# Altium project UZ_PER_SKAI3_LV_48V_410A.PrjPCB (part 1 of 2)
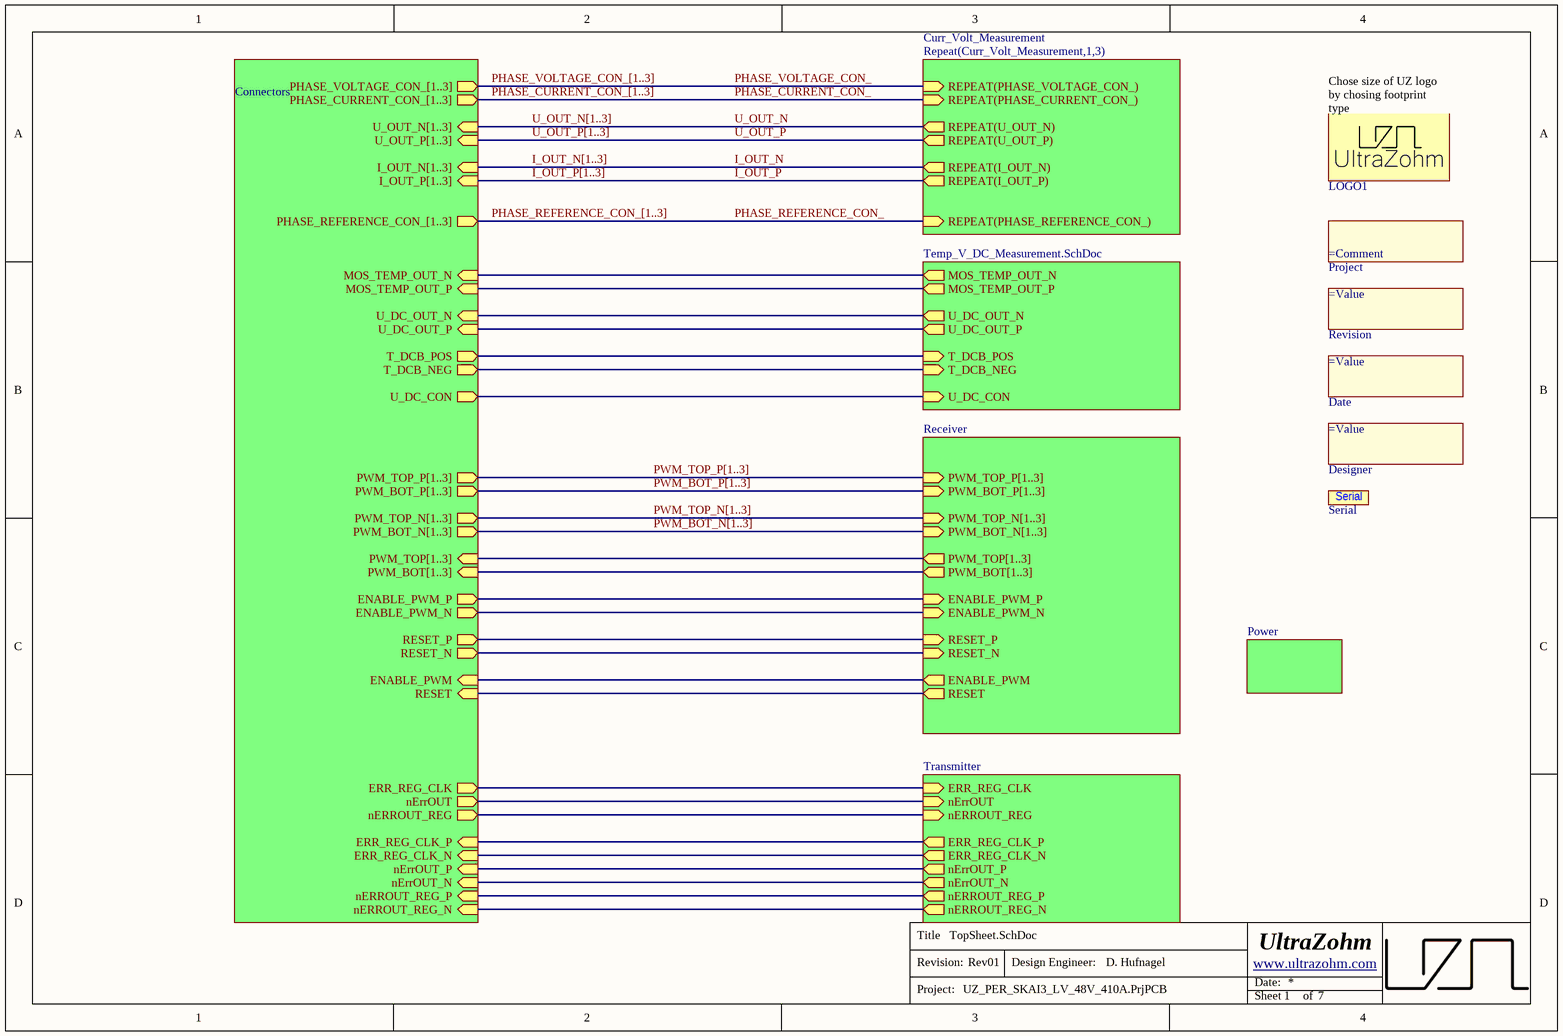
[diagram p0: TopSheet.SchDoc]
Author: D. Hufnagel; AuthorParam: D. Hufnagel; FinDate: 04/24; ProjectNameCustom: UZ_PER_SKAI3_LV_48V_410A; ProjectRevision: Rev01
7 sheets, 175 parts. Net scope: hierarchical (ports join the sheet entries above them; power ports are global).
Board file: UZ_PER_SKAI3_LV_48V_410A.PcbDoc
Sheets:
  TopSheet.SchDoc
     = Temp_V_DC_Measurement.SchDoc
     = Connectors.SchDoc
    Curr_Volt_Measurement1 = Curr_Volt_Measurement.SchDoc
    Curr_Volt_Measurement2 = Curr_Volt_Measurement.SchDoc
    Curr_Volt_Measurement3 = Curr_Volt_Measurement.SchDoc
     = Receiver.SchDoc
    Designator = Transmitter.SchDoc
    Designator = Power.SchDoc

## Sheet TopSheet.SchDoc
size A4; Author: D. Hufnagel; CompanyName: Technische Hochschule Nürnberg Georg Simon Ohm; Organization: UltraZohm; Address1: Kesslerplatz 12; Address2: 90489 Nürnberg; Address3: GERMANY; DocumentNumber: 1; SheetNumber: 1; SheetTotal: 7; Website: www.ultrazohm.com

### Parts
Date  (no value)  [COMMENT]  (no BOM)
Designer  (no value)  [Designator:comment]  (no BOM)
LOGO1  UZ Logo  [UZ_Logo_small]  (value not drawn)  (no BOM)
Project  (no value)  [COMMENT]  (no BOM)
Revision  (no value)  [Designator:comment]  (no BOM)
Serial  Serial #  [SERIAL]  (value not drawn)

### Sub-sheets
Designator = Transmitter: ERR_REG_CLK (in), nErrOUT (in), nERROUT_REG (in), ERR_REG_CLK_P (out), ERR_REG_CLK_N (out), nErrOUT_P (out), nErrOUT_N (out), nERROUT_REG_P (out), nERROUT_REG_N (out)
Designator = Power: no entries
Repeat(Curr_Volt_Measurement,1,3) = Curr_Volt_Measurement: REPEAT(PHASE_VOLTAGE_CON_) (in), REPEAT(U_OUT_N) (out), REPEAT(U_OUT_P) (out), REPEAT(PHASE_CURRENT_CON_) (in), REPEAT(PHASE_REFERENCE_CON_) (in), REPEAT(I_OUT_N) (out), REPEAT(I_OUT_P) (out)
? = Temp_V_DC_Measurement.SchDoc: MOS_TEMP_OUT_N (out), MOS_TEMP_OUT_P (out), U_DC_OUT_N (out), U_DC_OUT_P (out), T_DCB_POS (in), T_DCB_NEG (in), U_DC_CON (in)
? = Connectors: PHASE_REFERENCE_CON_[1..3] (out), U_OUT_P[1..3] (in), U_OUT_N[1..3] (in), PHASE_CURRENT_CON_[1..3] (out), PHASE_VOLTAGE_CON_[1..3] (out), U_DC_OUT_P (in), U_DC_OUT_N (in), MOS_TEMP_OUT_P (in), MOS_TEMP_OUT_N (in), PWM_TOP_P[1..3] (out), PWM_BOT_P[1..3] (out), PWM_TOP_N[1..3] (out), PWM_BOT_N[1..3] (out), ENABLE_PWM_P (out), ENABLE_PWM_N (out), RESET_P (out), RESET_N (out), ENABLE_PWM (in), RESET (in), ERR_REG_CLK (out), nErrOUT (out), nERROUT_REG (out), ERR_REG_CLK_P (in), ERR_REG_CLK_N (in), nErrOUT_P (in), nErrOUT_N (in), nERROUT_REG_P (in), nERROUT_REG_N (in), T_DCB_POS (out), T_DCB_NEG (out), U_DC_CON (out), PWM_BOT[1..3] (in), PWM_TOP[1..3] (in), I_OUT_N[1..3] (in), I_OUT_P[1..3] (in)
? = Receiver: PWM_TOP_P[1..3] (in), PWM_BOT_P[1..3] (in), PWM_TOP_N[1..3] (in), PWM_BOT_N[1..3] (in), ENABLE_PWM_P (in), ENABLE_PWM_N (in), RESET_P (in), RESET_N (in), ENABLE_PWM (out), RESET (out), PWM_BOT[1..3] (out), PWM_TOP[1..3] (out)

### Nets
ENABLE_PWM: sheet /ENABLE_PWM, sheet /ENABLE_PWM
ENABLE_PWM_N: sheet /ENABLE_PWM_N, sheet /ENABLE_PWM_N
ENABLE_PWM_P: sheet /ENABLE_PWM_P, sheet /ENABLE_PWM_P
ERR_REG_CLK: sheet /ERR_REG_CLK, sheet Designator/ERR_REG_CLK
ERR_REG_CLK_N: sheet /ERR_REG_CLK_N, sheet Designator/ERR_REG_CLK_N
ERR_REG_CLK_P: sheet /ERR_REG_CLK_P, sheet Designator/ERR_REG_CLK_P
I_OUT_N: sheet Repeat(Curr_Volt_Measurement,1,3)/REPEAT(I_OUT_N)
I_OUT_P: sheet Repeat(Curr_Volt_Measurement,1,3)/REPEAT(I_OUT_P)
MOS_TEMP: sheet /T_DCB_POS, sheet /T_DCB_POS
MOS_TEMP_OUT_N: sheet /MOS_TEMP_OUT_N, sheet /MOS_TEMP_OUT_N
MOS_TEMP_OUT_P: sheet /MOS_TEMP_OUT_P, sheet /MOS_TEMP_OUT_P
nErrOUT: sheet /nErrOUT, sheet Designator/nErrOUT
nErrOUT_N: sheet /nErrOUT_N, sheet Designator/nErrOUT_N
nErrOUT_P: sheet /nErrOUT_P, sheet Designator/nErrOUT_P
nERROUT_REG: sheet /nERROUT_REG, sheet Designator/nERROUT_REG
nERROUT_REG_N: sheet /nERROUT_REG_N, sheet Designator/nERROUT_REG_N
nERROUT_REG_P: sheet /nERROUT_REG_P, sheet Designator/nERROUT_REG_P
PHASE_CURRENT_CON_: sheet Repeat(Curr_Volt_Measurement,1,3)/REPEAT(PHASE_CURRENT_CON_)
PHASE_REFERENCE_CON_: sheet Repeat(Curr_Volt_Measurement,1,3)/REPEAT(PHASE_REFERENCE_CON_)
PHASE_VOLTAGE_CON_: sheet Repeat(Curr_Volt_Measurement,1,3)/REPEAT(PHASE_VOLTAGE_CON_)
RESET: sheet /RESET, sheet /RESET
RESET_N: sheet /RESET_N, sheet /RESET_N
RESET_P: sheet /RESET_P, sheet /RESET_P
T_DCB_NEG: sheet /T_DCB_NEG, sheet /T_DCB_NEG
U_DC_OUT_N: sheet /U_DC_OUT_N, sheet /U_DC_OUT_N
U_DC_OUT_P: sheet /U_DC_OUT_P, sheet /U_DC_OUT_P
U_OUT_N: sheet Repeat(Curr_Volt_Measurement,1,3)/REPEAT(U_OUT_N)
U_OUT_P: sheet Repeat(Curr_Volt_Measurement,1,3)/REPEAT(U_OUT_P)
NetC25_2: sheet /U_DC_CON, sheet /U_DC_CON

### Buses and harness runs
bus I_OUT_N[1..3] = sheet /I_OUT_N[1..3]
bus I_OUT_P[1..3] = sheet /I_OUT_P[1..3]
bus PHASE_CURRENT_CON_[1..3] = sheet /PHASE_CURRENT_CON_[1..3]
bus PHASE_REFERENCE_CON_[1..3] = sheet /PHASE_REFERENCE_CON_[1..3]
bus PHASE_VOLTAGE_CON_[1..3] = sheet /PHASE_VOLTAGE_CON_[1..3]
bus PWM_BOT_N[1..3] = sheet /PWM_BOT_N[1..3]
bus PWM_BOT_P[1..3] = sheet /PWM_BOT_P[1..3]
bus PWM_TOP_N[1..3] = sheet /PWM_TOP_N[1..3]
bus PWM_TOP_P[1..3] = sheet /PWM_TOP_P[1..3]
bus U_OUT_N[1..3] = sheet /U_OUT_N[1..3]
bus U_OUT_P[1..3] = sheet /U_OUT_P[1..3]

### Notes on the sheet
- (near LOGO1) Chose size of UZ logo by chosing footprint type
- Title
- Revision:
- Design Engineer:
- Date:
- Project:
- Sheet
- of

### Library data of the parts
Date = 5: Create a project parameter named "FinDate" this is the value of this component. It is printed on the PCB. Once the parameter is updated (e.g. new revision) it gets updated on the PCB as well; Manufacturer: PCB Manufacturer; Manufacturer Part Number: Project End Date; Value: 04/24; Created from: T. Wendt; PartID: 5; Created On: 01.03.2021 09:01:41; Component Type: Date of Project Finalization; Last Updated: 01.03.2021 09:01:41; Type: Standard (No BOM); Live Cycle Status: 1
Designer = 4: Create a project parameter named "Author" this is the value of this component. It is printed on the PCB. Once the parameter is updated (e.g. new revision) it gets updated on the PCB as well; Manufacturer: PCB Manufacturer; Manufacturer Part Number: Project Author; Value: D. Hufnagel; Created from: T. Wendt; PartID: 4; Created On: 01.03.2021 08:53:41; Component Type: Project Author; Last Updated: 01.03.2021 09:20:27; Type: Standard (No BOM); Live Cycle Status: 1
LOGO1 = 1: Official Project Logo of the UltraZohm; Manufacturer: PCB Manufacturer; Manufacturer Part Number: UltraZohm Logo; Created from: T. Wendt; PartID: 1; Created On: 19.02.2021 16:55:56; ComponentLink1Description: Homepage; ComponentLink1URL: https://ultrazohm.com; Component Type: Logo; Last Updated: 02.03.2021 14:31:24; Type: Standard (No BOM); Live Cycle Status: 1
Project = 2: Create a project parameter named "ProjectNameCustom" this is the value of this component and it is printed on the PCB.; Manufacturer: PCB Manufacturer; Value: UZ_PER_SKAI3_LV_48V_410A; Created from: T. Wendt; PartID: 2; Created On: 01.03.2021 08:43:57; Component Type: Project Name; Last Updated: 01.03.2021 09:07:27; Manufacturer Part Number: Project Name; Type: Standard (No BOM); Live Cycle Status: 1
Revision = 3: Create a project parameter named "ProjectRevision" this is the value of this component. It is printed on the PCB. Once the parameter is updated (e.g. new revision) it gets updated on the PCB as well; Manufacturer: PCB Manufacturer; Value: Rev01; Created from: T. Wendt; PartID: 3; Created On: 01.03.2021 08:50:34; Component Type: Project Revision; Last Updated: 01.03.2021 09:28:36; Manufacturer Part Number: Project Revision; Type: Standard (No BOM); Live Cycle Status: 1
Serial = 6: Field to put in a serial number; Manufacturer: PCB Manufacturer; Created from: T. Wendt; PartID: 6; Created On: 02.03.2021 14:31:24; Component Type: Serial Number; Last Updated: 02.03.2021 14:31:24; Manufacturer Part Number: Serial Number; Type: Standard (No BOM); Live Cycle Status: 1

## Sheet Temp_V_DC_Measurement.SchDoc
size A4; Author: D. Hufnagel; CompanyName: Technische Hochschule Nürnberg Georg Simon Ohm; Organization: UltraZohm; Address1: Kesslerplatz 12; Address2: 90489 Nürnberg; Address3: GERMANY; SheetNumber: 5; SheetTotal: 7; Website: www.ultrazohm.com
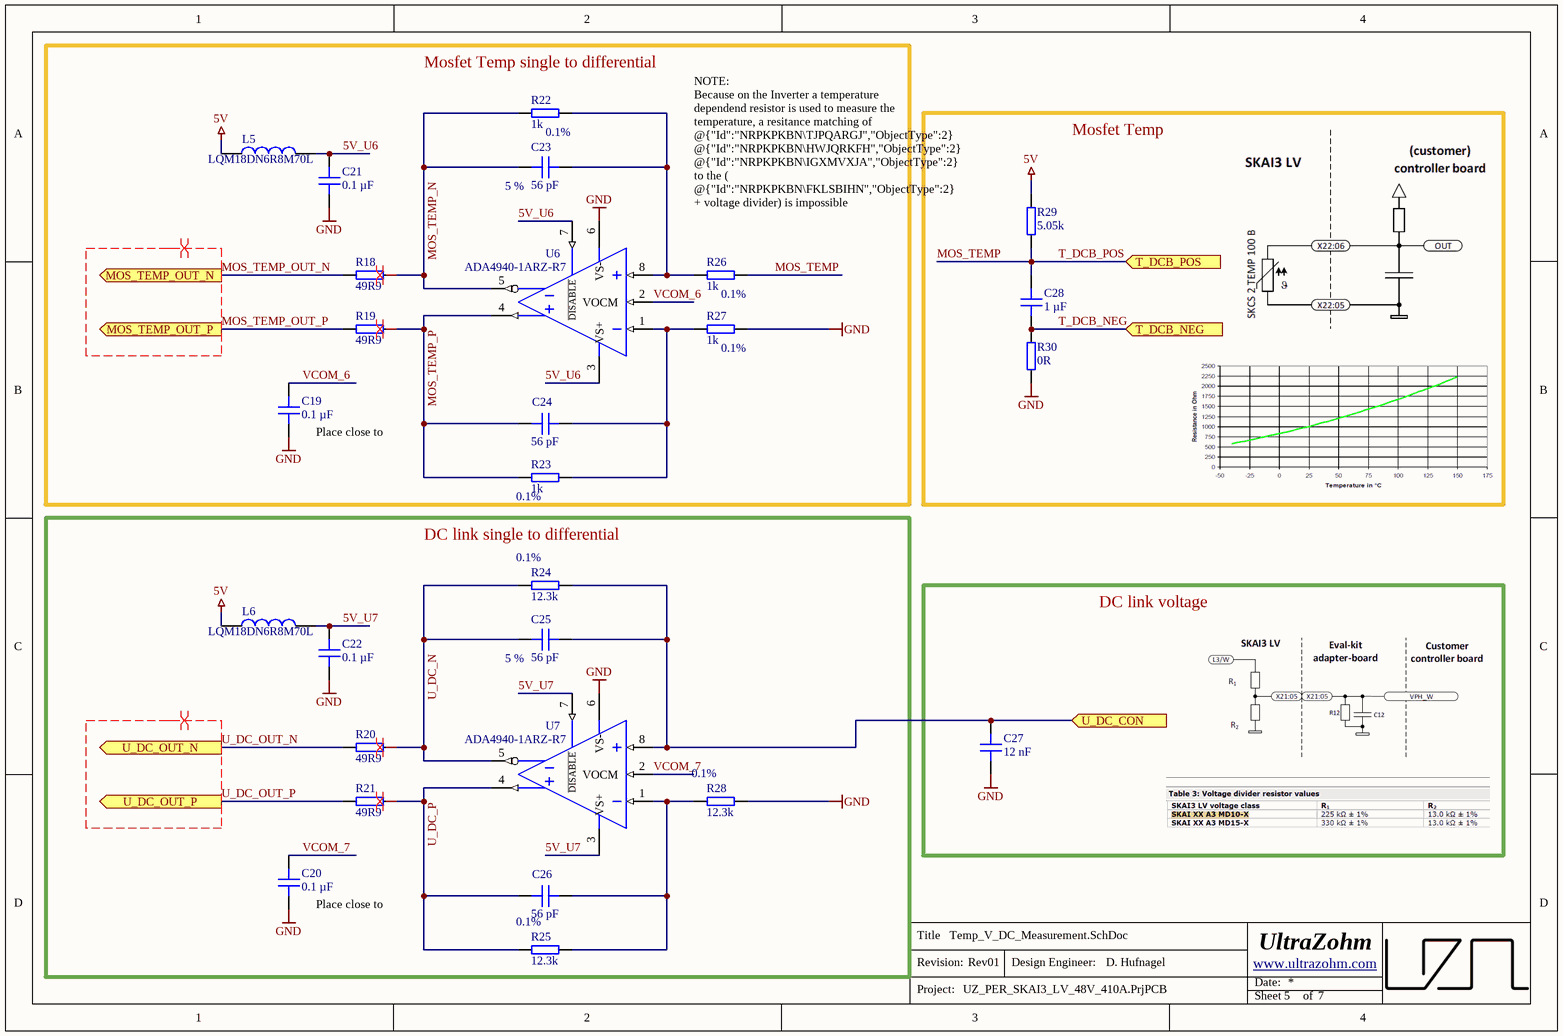
[diagram p1: Temp_V_DC_Measurement.SchDoc]

### Parts
C19  0.1 µF  [C_0603]
C20  0.1 µF  [C_0603]
C21  0.1 µF  [C_0603]
C22  0.1 µF  [C_0603]
C23  56 pF  Tolerance: 5 %  [C_0603]
C24  56 pF  [C_0603]
C25  56 pF  Tolerance: 5 %  [C_0603]
C26  56 pF  [C_0603]
C27  12 nF  [C_0603]
C28  1 µF  [C_1206]
L5  LQM18DN6R8M70L  [INDC1608X95N]
L6  LQM18DN6R8M70L  [INDC1608X95N]
R18  49R9  [RES 0603_1608]
R19  49R9  [RES 0603_1608]
R20  49R9  [RES 0603_1608]
R21  49R9  [RES 0603_1608]
R22  1k  Tolerance: 0.1%  [RES 0603_1608]
R23  1k  Tolerance: 0.1%  [RES 0603_1608]
R24  12.3k  Tolerance: 0.1%  [RES 0603_1608]
R25  12.3k  Tolerance: 0.1%  [RES 0603_1608]
R26  1k  Tolerance: 0.1%  [RES 0603_1608]
R27  1k  Tolerance: 0.1%  [RES 0603_1608]
R28  12.3k  Tolerance: 0.1%  [RES 0603_1608]
R29  5.05k  [RES 0603_1608]
R30  0R  [RES 0603_1608]
U6  ADA4940-1ARZ-R7  [SOT127P600X175-8N]
U7  ADA4940-1ARZ-R7  [SOT127P600X175-8N]

### Blocks framed on the sheet
Mosfet Temp single to differential: C19 C21 C23 C24 L5 R18 R19 R22 R23 R26 R27 U6
Mosfet Temp: C28 R29 R30
DC link single to differential: C20 C22 C25 C26 L6 R20 R21 R24 R25 R28 U7
DC link voltage: C27

### Ports
MOS_TEMP_OUT_N (out), MOS_TEMP_OUT_P (out), T_DCB_NEG (in), T_DCB_POS (in), U_DC_CON (in), U_DC_OUT_N (out), U_DC_OUT_P (out)

### Nets
5V: L5.1 L6.1 R29.2
GND: C19.1 C20.1 C21.1 C22.1 C27.1 R27.1 R28.2 R30.1 U6.6(VS-) U7.6(VS-)
5V_U6: C21.2 L5.2 U6.3(VS+) U6.7(~{DISABLE})
5V_U7: C22.2 L6.2 U7.3(VS+) U7.7(~{DISABLE})
MOS_TEMP: C28.2 R26.1 R29.1 ; port T_DCB_POS  [also labelled T_DCB_POS]
MOS_TEMP_N: C23.1 R18.2 R22.2 U6.5(VOUT-)
MOS_TEMP_OUT_N: R18.1 ; port MOS_TEMP_OUT_N
MOS_TEMP_OUT_P: R19.1 ; port MOS_TEMP_OUT_P
MOS_TEMP_P: C24.1 R19.2 R23.2 U6.4(VOUT+)
T_DCB_NEG: C28.1 R30.2 ; port T_DCB_NEG
U_DC_N: C25.1 R20.2 R24.1 U7.5(VOUT-)
U_DC_OUT_N: R20.1 ; port U_DC_OUT_N
U_DC_OUT_P: R21.1 ; port U_DC_OUT_P
U_DC_P: C26.1 R21.2 R25.1 U7.4(VOUT+)
VCOM_6: C19.2 U6.2(VOCM)
VCOM_7: C20.2 U7.2(VOCM)
NetC23_2: C23.2 R22.1 R26.2 U6.8(VIN+)
NetC24_2: C24.2 R23.1 R27.2 U6.1(VIN-)
NetC25_2: C25.2 C27.2 R24.2 U7.8(VIN+) ; port U_DC_CON
NetC26_2: C26.2 R25.2 R28.1 U7.1(VIN-)

### Layout directives
differential pair: MOS_TEMP_N, MOS_TEMP_OUT_N, MOS_TEMP_OUT_P, MOS_TEMP_P, U_DC_N, U_DC_OUT_N, U_DC_OUT_P, U_DC_P

### Notes on the sheet
- (near R26) NOTE:
  Because on the Inverter a temperature dependend resistor is used to measure the temperature, a resitance matching of @{"Id":"NRPKPKBN\TJPQARGJ","ObjectType":2} @{"Id":"NRPKPKBN\HWJQRKFH","ObjectType":2} @{"Id":"NRPKPKBN\IGXMVXJA","ObjectType":2} to the ( @{"Id":"NRPKPKBN\FKLSBIHN","ObjectType":2} + voltage divider) is impossible
- (near C19) Place close to @{"Id":"NRPKPKBN\YIMAHXXS","ObjectType":2}
- (near C20) Place close to @{"Id":"NRPKPKBN\RQVLHYIW","ObjectType":2}
- Title
- Revision:
- Design Engineer:
- Date:
- Project:
- Sheet
- of

### Library data of the parts
C19-C22 = C0603X104K5RAC7411: Capacitor 0603, 50 VDC, 0.1 µF, X7R; Manufacturer: KEMET; Tolerance: 10 %; Voltage Rating: 50 VDC; Created from: MGremer; Manufacturer Part Number: C0603X104K5RAC7411; PartID: 3; Created On: 20.12.2020 13:54:13; ComponentLink1Description: Datasheet; ComponentLink1URL: https://www.mouser.de/datasheet/2/212/1/KEM_C1013_X7R_FT_CAP_SMD-1103280.pdf; Component Type: Capacitor 0603; Device Package: 0603; Last Updated: 04.03.2021 09:24:28; Mounting Type: SMD; Operating Temperature: -55 - 125°C; Series: SMD Comm X7R Flex; Supplier 1: Mouser; Supplier Part Number 1: 80-C0603X104K5R7411; Supplier 2: LCSC; Supplier Part Number 2: C14663; Type: Capacitor; Value: 0.1 µF; Live Cycle Status: 1; LCSC Part Number: C14663; Stock number: Labor SMD Container
C23 C25 = CL10C560JB8NNNC: Capacitor 0603, 50 VDC, 56 pF, C0G; Manufacturer: Samsung Electro-Mechanics; Voltage Rating: 50 VDC; Created from: DHufnagel; Manufacturer Part Number: CL10C560JB8NNNC; PartID: 92; Created On: 20.12.2020 13:54:13; ComponentLink1Description: Datasheet; ComponentLink1URL: https://www.mouser.de/datasheet/2/585/MLCC-1837944.pdf; Component Type: Capacitor 0603; Device Package: 0603; Last Updated: 20.12.2020 16:24:16; Mounting Type: SMD; Operating Temperature: -55 - 125°C; Series: CL; Supplier 1: Mouser; Supplier Part Number 1: 187-CL10C560JB8NNNC; Type: Capacitor; Value: 56 pF; Live Cycle Status: 1; Stock number: not stored; Supplier 2: LCSC; Supplier Part Number 2: C39148; LCSC Part Number: C39148
C24 C26 = CL10C560JB8NNNC: Capacitor 0603, 50 VDC, 56 pF, C0G; Manufacturer: Samsung Electro-Mechanics; Tolerance: 5 %; Voltage Rating: 50 VDC; Created from: DHufnagel; Manufacturer Part Number: CL10C560JB8NNNC; PartID: 92; Created On: 20.12.2020 13:54:13; ComponentLink1Description: Datasheet; ComponentLink1URL: https://www.mouser.de/datasheet/2/585/MLCC-1837944.pdf; Component Type: Capacitor 0603; Device Package: 0603; Last Updated: 20.12.2020 16:24:16; Mounting Type: SMD; Operating Temperature: -55 - 125°C; Series: CL; Supplier 1: Mouser; Supplier Part Number 1: 187-CL10C560JB8NNNC; Supplier 2: LCSC; Supplier Part Number 2: C39148; Type: Capacitor; Value: 56 pF; Live Cycle Status: 1; LCSC Part Number: C39148; Stock number: not stored
C27 = CC0603KRX7R7BB123: Capacitor 0603, 16 VDC, 12 nF, X7R; Manufacturer: Yageo; Tolerance: 10 %; Voltage Rating: 16 VDC; Created from: MGremer; Manufacturer Part Number: CC0603KRX7R7BB123; PartID: 47; Created On: 20.12.2020 13:54:13; ComponentLink1Description: Datasheet; ComponentLink1URL: https://www.mouser.de/datasheet/2/447/UPY-GPHC_X7R_6.3V-to-50V_18-1154002.pdf; Component Type: Capacitor 0603; Device Package: 0603; Last Updated: 16.04.2024 13:21:40; Mounting Type: SMD; Operating Temperature: -55 - 125°C; Series: CC; Supplier 1: Mouser; Supplier Part Number 1: 603-CC603KRX7R7BB123; Type: Capacitor; Value: 12 nF; Live Cycle Status: 1; LCSC Part Number: C519427; Stock number: not stored
C28 = C1206X105K5RECAUTO: Capacitor 1206, 50 VDC, 1 µF, X7R; Manufacturer: KEMET; Tolerance: 10 %; Voltage Rating: 50 VDC; Created from: MGremer; Manufacturer Part Number: C1206X105K5RECAUTO; PartID: 39; Created On: 20.12.2020 13:54:13; ComponentLink1Description: Datasheet; ComponentLink1URL: https://www.mouser.de/datasheet/2/212/1/KEM_C1090_X7R_ESD-1103328.pdf; Component Type: Capacitor 1206; Device Package: 1206; Last Updated: 24.10.2023 13:41:37; Mounting Type: SMD; Operating Temperature: -55 - 125°C; Series: ESD SMD Auto X7R; Supplier 1: Mouser; Supplier Part Number 1: 80-C1206X105K5REAUTO; Type: Capacitor; Value: 1 µF; Live Cycle Status: 1; LCSC Part Number: C107185; Stock number: Labor SMD Container
L5 L6 = LQM18DN6R8M70L: 6.8µH, 120mA, 0603, 740mOhm, 20%; Manufacturer: Murata; MF: EPCOS / TDK; Value: 6.8uH; DCR: 320m; Rated Current: 0.85 A; Type: fixed inductor; Created from: DHufnagel; MPN: B82464G4154M; Supplier 1: Mouser; Supplier Part Number 1: 81-LQM18DN6R8M70L; Manufacturer Part Number: LQM18DN6R8M70L; PartID: 10; Created On: 19.07.2022 15:47:17; ComponentLink1Description: Datasheet; ComponentLink1URL: https://www.mouser.de/datasheet/2/281/1/JELF243B_0086-2298241.pdf; Component Type: SMD fixed inductor; Device Package: SMD; Last Updated: 15.06.2023 16:03:16; Mounting Type: SMD; Operating Temperature: -40 - 125°C; Series: LQM18DN_70; Supplier 2: Digi-Key; Supplier Part Number 2: 490-LQM18DN6R8M70LCT-ND; DC current: 120mA; Live Cycle Status: 1; Stock number: not stored; LCSC Part Number: C1881372
R18-R21 = RK73H1JTTD49R9F: SMD resistor 1%; Manufacturer: KOA Speer; Created from: DHufnagel; Manufacturer Part Number: RK73H1JTTD49R9F; PartID: 214; Created On: 14.12.2020 16:17:14; ComponentLink1Description: Datasheet; ComponentLink1URL: https://www.mouser.de/datasheet/2/219/RK73H-1825326.pdf; Component Type: SMD resistor; Device Package: 0603; Last Updated: 27.05.2022 13:46:35; Mounting Type: SMD; Supplier 1: Mouser; Supplier Part Number 1: 660-RK73H1JTTD49R9F; Supplier 2: LCSC; Supplier Part Number 2: C160046; Type: Resistor; Tolerance: 1%; Value: 49R9; Live Cycle Status: 1; Stock number: not stored; LCSC Part Number: C160046
R22 R23 R26 R27 = PCF-W0603LF-03-1001-B-P-LT: SMD resistor 0.1%; Manufacturer: IRC / TT Electronics; Created from: MGremer; Manufacturer Part Number: PCF-W0603LF-03-1001-B-P-LT; PartID: 163; Created On: 14.12.2020 16:17:14; ComponentLink1Description: Datasheet; ComponentLink1URL: https://www.mouser.de/datasheet/2/414/PCF-1528243.pdf; Component Type: SMD resistor; Device Package: 0603; Last Updated: 21.02.2024 15:45:55; Mounting Type: SMD; Supplier 1: Mouser; Supplier Part Number 1: 66-PCFW0603LF031001B; Type: Resistor; Value: 1k; Live Cycle Status: 1; Stock number: not stored; LCSC Part Number: C110776
R24 R25 R28 = RT0603BRD0712K3L: SMD resistor E24 series 12 kOhms 100mW 0603 1%; Manufacturer: YAGEO; Created from: DHufnagel; Manufacturer Part Number: RT0603BRD0712K3L; PartID: 333; Created On: 10.02.2023 10:27:45; ComponentLink1Description: Datasheet; ComponentLink1URL: https://www.mouser.de/datasheet/2/447/PYu_RT_1_to_0_01_RoHS_L_12-3003070.pdf; Component Type: SMD resistor; Device Package: 0603; Last Updated: 03.05.2024 10:37:15; Mounting Type: SMD; Supplier 1: Mouser; Supplier Part Number 1: 603-RT0603BRD0712K3L; Type: Resistor; Value: 12.3k; Live Cycle Status: 1; Stock number: not stored; LCSC Part Number: C861101
R29 = TNPW06035K05BEEA: SMD resistor 0.1%; Manufacturer: Vishay; Created from: DHufnagel; Manufacturer Part Number: TNPW06035K05BEEA; PartID: 338; Created On: 01.12.2022 09:50:56; ComponentLink1Description: Datasheet; ComponentLink1URL: https://www.vishay.com/doc?28758; Component Type: SMD resistor; Device Package: 0603; Last Updated: 03.05.2024 10:51:07; Mounting Type: SMD; Supplier 1: Mouser; Supplier Part Number 1: 71-TNPW06035K05BEEA; Type: Resistor; Tolerance: 0.1%; Value: 5.05k; Live Cycle Status: 1; Stock number: not stored; LCSC Part Number: C1693738
R30 = RC0603JR-070RL: SMD resistor E24 series; Manufacturer: YAGEO; Tolerance: 5%; Created from: MGremer; Manufacturer Part Number: RC0603JR-070RL; PartID: 1; Created On: 14.12.2020 16:17:14; ComponentLink1Description: Datasheet; ComponentLink1URL: https://www.mouser.de/datasheet/2/447/PYu-RC_Group_51_RoHS_L_10-1664068.pdf; Component Type: SMD resistor; Device Package: 0603; Last Updated: 04.03.2021 09:09:42; Mounting Type: SMD; Supplier 1: Mouser; Supplier Part Number 1: 603-RC0603JR-070RL; Supplier 2: LCSC; Supplier Part Number 2: C21189; Type: Resistor; Value: 0R; Live Cycle Status: 1; Stock number: Labor SMD Container; LCSC Part Number: C21189
U6 U7 = ADA4940-1ARZ-R7: Fully Differential Amplifier, Ultralow-Power,Low Distortion, 260-MHz; Manufacturer: Analog Devices; Channels: 1; GBP: 260 MHz; CMRR: 86 dB; Created from: DHufnagel; Manufacturer Part Number: ADA4940-1ARZ-R7; PartID: 14; Created On: 18.08.2022 12:53:27; ComponentLink1Description: Datasheet; ComponentLink1URL: https://www.mouser.de/datasheet/2/609/ada4940_1_4940_2-2955874.pdf; Component Type: Differential Amplifier; Device Package: SOIC-8; Last Updated: 18.08.2022 13:04:18; Mounting Type: SMD; Operating Temperature: -40 - 105°C; Series: ADA4940-1; Supplier 1: Mouser; Supplier Part Number 1: 584-ADA4940-1ARZ; Supplier 2: Digi-Key; Supplier Part Number 2: 505-ADA4940-1ARZ-ND; Supplier 3: LCSC; Supplier Part Number 3: C730049; Type: Differential Amplifiers; Live Cycle Status: 1; LCSC Part Number: C730049; Stock number: not stored

## Sheet Connectors.SchDoc
size A4; Author: D. Hufnagel; CompanyName: Technische Hochschule Nürnberg Georg Simon Ohm; Organization: UltraZohm; Address1: Kesslerplatz 12; Address2: 90489 Nürnberg; Address3: GERMANY; SheetNumber: 2; SheetTotal: 7; Website: www.ultrazohm.com
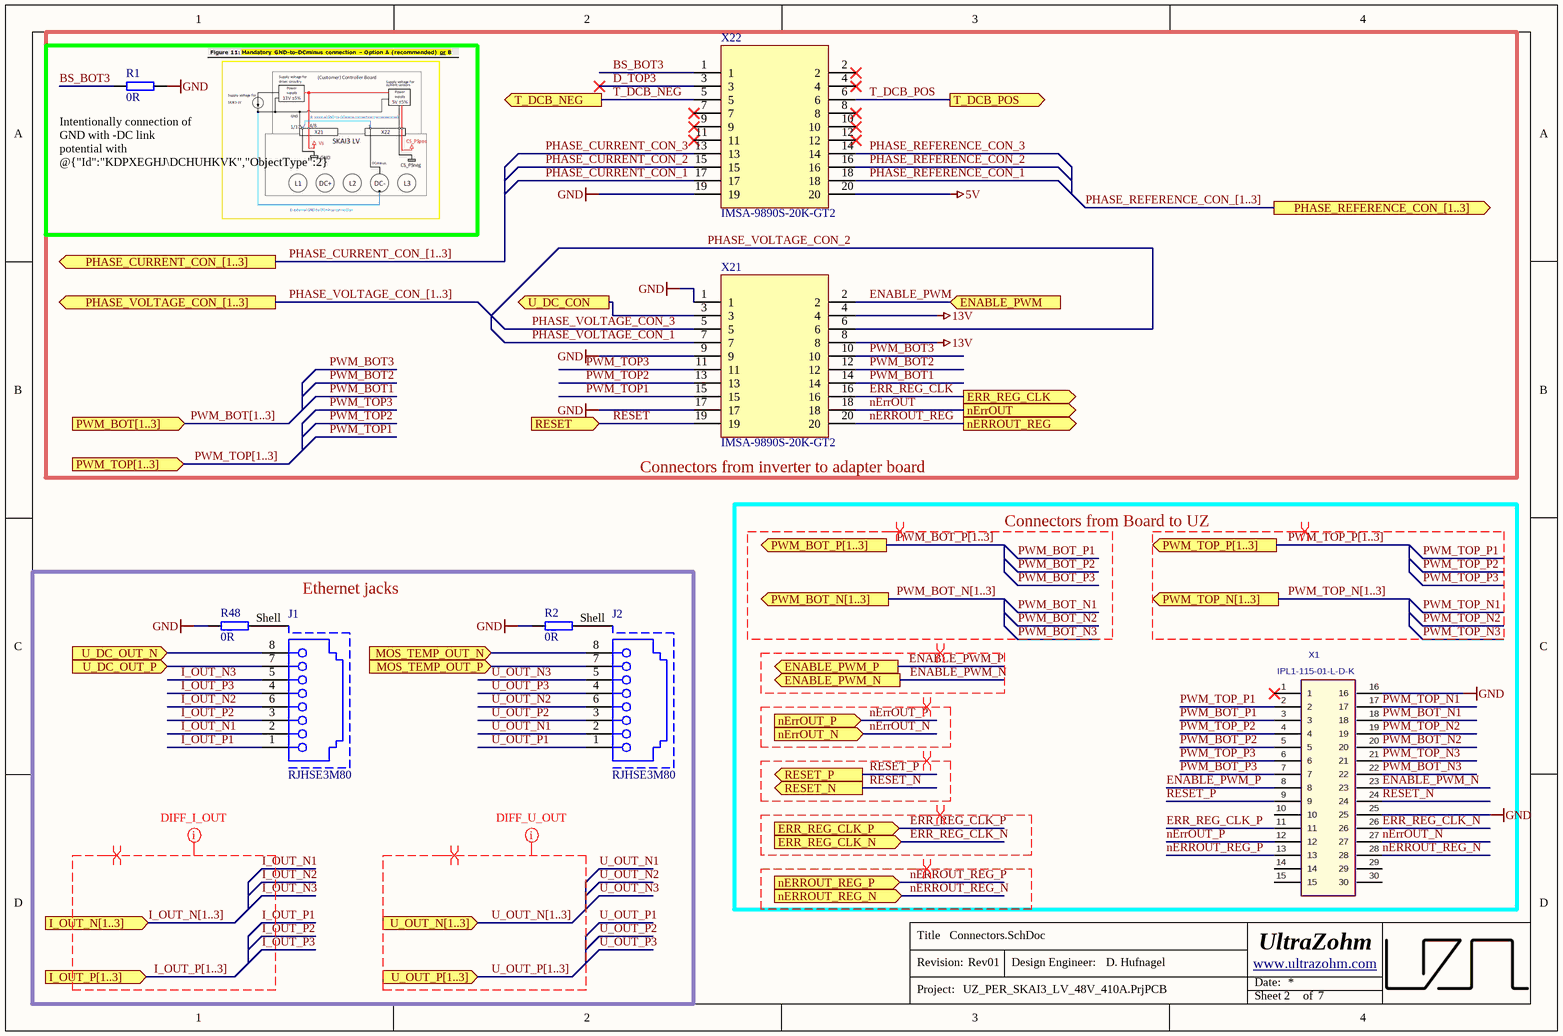
[diagram p2: Connectors.SchDoc]

### Parts
J1  RJHSE3M80  [RJHSE3M80]
J2  RJHSE3M80  [RJHSE3M80]
R1  0R  [RES 0603_1608]
R2  0R  [RES 0603_1608]
R48  0R  [RES 0603_1608]
X1  IPL1-115-01-L-D-K  [IPL1-115-01-YYY-D-K]
X21  IMSA-9890S-20K-GT2  [IMSA-9890S-20Z924]
X22  IMSA-9890S-20K-GT2  [IMSA-9890S-20Z924]

### Blocks framed on the sheet
Connectors from inverter to adapter board: R1 X21 X22
Connectors from Board to UZ: X1
Ethernet jacks: J1 J2 R2 R48

### Ports
ENABLE_PWM (in), ENABLE_PWM_N (out), ENABLE_PWM_P (out), ERR_REG_CLK (out), ERR_REG_CLK_N (in), ERR_REG_CLK_P (in), I_OUT_N[1..3] (in), I_OUT_P[1..3] (in), MOS_TEMP_OUT_N (in), MOS_TEMP_OUT_P (in), nErrOUT (out), nErrOUT_N (in), nErrOUT_P (in), nERROUT_REG (out), nERROUT_REG_N (in), nERROUT_REG_P (in), PHASE_CURRENT_CON_[1..3] (out), PHASE_REFERENCE_CON_[1..3] (out), PHASE_VOLTAGE_CON_[1..3] (out), PWM_BOT[1..3] (in), PWM_BOT_N[1..3] (out), PWM_BOT_P[1..3] (out), PWM_TOP[1..3] (in), PWM_TOP_N[1..3] (out), PWM_TOP_P[1..3] (out), RESET (in), RESET_N (out), RESET_P (out), T_DCB_NEG (out), T_DCB_POS (out), U_DC_CON (out), U_DC_OUT_N (in), U_DC_OUT_P (in), U_OUT_N[1..3] (in), U_OUT_P[1..3] (in)

### Nets
5V: X22.20
13V: X21.4 X21.8
GND: R1.2 R2.1 R48.1 X1.16 X1.25 X21.1 X21.9 X21.17 X22.19
BS_BOT3: R1.1 X22.1
D_TOP3: X22.3
ENABLE_PWM: X21.2 ; port ENABLE_PWM
ENABLE_PWM_N: X1.23 ; port ENABLE_PWM_N
ENABLE_PWM_P: X1.8 ; port ENABLE_PWM_P
ERR_REG_CLK: X21.16 ; port ERR_REG_CLK
ERR_REG_CLK_N: X1.26 ; port ERR_REG_CLK_N
ERR_REG_CLK_P: X1.11 ; port ERR_REG_CLK_P
I_OUT_N1: J1.2  [project net I_OUT_N]
I_OUT_N2: J1.6  [project net I_OUT_N]
I_OUT_N3: J1.5  [project net I_OUT_N]
I_OUT_P1: J1.1  [project net I_OUT_P]
I_OUT_P2: J1.3  [project net I_OUT_P]
I_OUT_P3: J1.4  [project net I_OUT_P]
MOS_TEMP_OUT_N: J2.8 ; port MOS_TEMP_OUT_N
MOS_TEMP_OUT_P: J2.7 ; port MOS_TEMP_OUT_P
nErrOUT: X21.18 ; port nErrOUT
nErrOUT_N: X1.27 ; port nErrOUT_N
nErrOUT_P: X1.12 ; port nErrOUT_P
nERROUT_REG: X21.20 ; port nERROUT_REG
nERROUT_REG_N: X1.28 ; port nERROUT_REG_N
nERROUT_REG_P: X1.13 ; port nERROUT_REG_P
PHASE_CURRENT_CON_1: X22.17
PHASE_CURRENT_CON_2: X22.15
PHASE_CURRENT_CON_3: X22.13
PHASE_REFERENCE_CON_1: X22.18
PHASE_REFERENCE_CON_2: X22.16
PHASE_REFERENCE_CON_3: X22.14
PHASE_VOLTAGE_CON_1: X21.7
PHASE_VOLTAGE_CON_2: X21.6
PHASE_VOLTAGE_CON_3: X21.5
PWM_BOT1: X21.14
PWM_BOT2: X21.12
PWM_BOT3: X21.10
PWM_BOT_N1: X1.18
PWM_BOT_N2: X1.20
PWM_BOT_N3: X1.22
PWM_BOT_P1: X1.3
PWM_BOT_P2: X1.5
PWM_BOT_P3: X1.7
PWM_TOP1: X21.15
PWM_TOP2: X21.13
PWM_TOP3: X21.11
PWM_TOP_N1: X1.17
PWM_TOP_N2: X1.19
PWM_TOP_N3: X1.21
PWM_TOP_P1: X1.2
PWM_TOP_P2: X1.4
PWM_TOP_P3: X1.6
RESET: X21.19 ; port RESET
RESET_N: X1.24 ; port RESET_N
RESET_P: X1.9 ; port RESET_P
T_DCB_NEG: X22.5 ; port T_DCB_NEG
T_DCB_POS: X22.6 ; port T_DCB_POS  [project net MOS_TEMP]
U_DC_OUT_N: J1.8 ; port U_DC_OUT_N
U_DC_OUT_P: J1.7 ; port U_DC_OUT_P
U_OUT_N1: J2.2  [project net U_OUT_N]
U_OUT_N2: J2.6  [project net U_OUT_N]
U_OUT_N3: J2.5  [project net U_OUT_N]
U_OUT_P1: J2.1  [project net U_OUT_P]
U_OUT_P2: J2.3  [project net U_OUT_P]
U_OUT_P3: J2.4  [project net U_OUT_P]
NetC25_2: X21.3 ; port U_DC_CON
NetJ1_Shell: J1.Shell R48.2
NetJ2_Shell: J2.Shell R2.2

Not connected (* = marked no-connect by the designer): X1 1* 10 14 15 29 30; X22 2* 4* 7* 8* 9* 10* 11* 12*

### Buses and harness runs
bus I_OUT_N[1..3] = port I_OUT_N[1..3]
bus I_OUT_P[1..3] = port I_OUT_P[1..3]
bus PHASE_CURRENT_CON_[1..3] = port PHASE_CURRENT_CON_[1..3]
bus PHASE_REFERENCE_CON_[1..3] = port PHASE_REFERENCE_CON_[1..3]
bus PHASE_VOLTAGE_CON_[1..3] = port PHASE_VOLTAGE_CON_[1..3]
bus PWM_BOT[1..3] = port PWM_BOT[1..3]
bus PWM_BOT_N[1..3] = port PWM_BOT_N[1..3]
bus PWM_BOT_P[1..3] = port PWM_BOT_P[1..3]
bus PWM_TOP[1..3] = port PWM_TOP[1..3]
bus PWM_TOP_N[1..3] = port PWM_TOP_N[1..3]
bus PWM_TOP_P[1..3] = port PWM_TOP_P[1..3]
bus U_OUT_N[1..3] = port U_OUT_N[1..3]
bus U_OUT_P[1..3] = port U_OUT_P[1..3]

### Layout directives
differential pair: ENABLE_PWM_N, ENABLE_PWM_P, ERR_REG_CLK_N, ERR_REG_CLK_P, I_OUT_N1, I_OUT_N2, I_OUT_N3, I_OUT_N[1..3], I_OUT_P1, I_OUT_P2, I_OUT_P3, I_OUT_P[1..3], nErrOUT_N, nErrOUT_P, nERROUT_REG_N, nERROUT_REG_P, PWM_BOT_N1, PWM_BOT_N2, PWM_BOT_N3, PWM_BOT_N[1..3], PWM_BOT_P1, PWM_BOT_P2, PWM_BOT_P3, PWM_BOT_P[1..3], PWM_TOP_N1, PWM_TOP_N2, PWM_TOP_N3, PWM_TOP_N[1..3], PWM_TOP_P1, PWM_TOP_P2, PWM_TOP_P3, PWM_TOP_P[1..3], RESET_N, RESET_P, U_OUT_N[1..3], U_OUT_P[1..3]
net class DIFF_I_OUT: I_OUT_N1, I_OUT_N2, I_OUT_N3, I_OUT_N[1..3], I_OUT_P1, I_OUT_P2, I_OUT_P3, I_OUT_P[1..3]
net class DIFF_U_OUT: U_OUT_N[1..3], U_OUT_P[1..3]

### Notes on the sheet
- (near R1) Intentionally connection of GND with -DC link potential with @{"Id":"KDPXEGHJ\DCHUHKVK","ObjectType":2}
- Title
- Revision:
- Design Engineer:
- Date:
- Project:
- Sheet
- of

### Library data of the parts
J1 J2 = RJHSE3M80: CAT5, RJ45 Connector, 1 port, vertical; Manufacturer: Amphenol; Created from: DHufnagel; Manufacturer Part Number: RJHSE3M80; PartID: 12; Created On: 06.06.2023 05:55:53; ComponentLink1Description: Datasheet; ComponentLink1URL: https://cdn.amphenol-cs.com/media/wysiwyg/files/documentation/datasheet/inputoutput/io-modjack-rjhse.pdf; Component Type: RJ45 Connector; Device Package: RJ45; Last Updated: 06.06.2023 05:55:53; Mounting Type: THT; Series: RJHSE; Supplier 1: Mouser; Supplier Part Number 1: 523-RJHSE3M80; Supplier 2: LCSC; Supplier Part Number 2: C3179193; Type: RJ45 Connector; Live Cycle Status: 1; LCSC Part Number: C3179193; Stock number: not stored
R1 R2 R48 = RC0603JR-070RL: as R30 on sheet Temp_V_DC_Measurement; Manufacturer Part Number: RC0603JR-070RL; PartID: 1; Created On: 14.12.2020 16:17:14; ComponentLink1Description: Datasheet; ComponentLink1URL: https://www.mouser.de/datasheet/2/447/PYu-RC_Group_51_RoHS_L_10-1664068.pdf; Component Type: SMD resistor; Device Package: 0603; Last Updated: 04.03.2021 09:09:42; Mounting Type: SMD; Supplier 1: Mouser; Supplier Part Number 1: 603-RC0603JR-070RL; Supplier 2: LCSC; Supplier Part Number 2: C21189; Type: Resistor; Value: 0R; Live Cycle Status: 1; Stock number: Labor SMD Container; LCSC Part Number: C21189
X1 = IPL1-115-01-L-D-K: 2.54 mm Double Row Terminal Assembly; Manufacturer: SAMTEC; Created from: MGremer; Number of positions: 30; Manufacturer Part Number: IPL1-115-01-L-D-K; PartID: 28; Created On: 01.12.2020 18:14:32; ComponentLink1Description: Homepage; ComponentLink1URL: https://www.samtec.com/de/products/ipl1; Component Type: Samtec Connector; Device Package: Connector; Last Updated: 15.02.2021 10:08:03; Mounting Type: THT; Supplier 1: SAMTEC; Supplier Part Number 1: IPL1-115-01-L-D-K; Type: Connector; Live Cycle Status: 1; Number of rows: 2; Stock number: not stored
X21 X22 = IMSA-9890S-20K-GT2: Board to Board Connector; Manufacturer: IRISO; Created from: DHufnagel; Number of positions: 20; Manufacturer Part Number: IMSA-9890S-20K-GT2; PartID: 22; Created On: 26.02.2021 16:36:12; ComponentLink1Description: Homepage; ComponentLink1URL: https://www.irisoele.com/cn/products/view/IMSA-9890S-20Z924/; Component Type: Board to Board Connector; Device Package: THT; Last Updated: 26.02.2021 16:37:20; Mounting Type: THT; Series: 9890S; Supplier 1: IRISO; Supplier Part Number 1: IMSA-9890S-20Z924; Type: Board to Board Connector; Live Cycle Status: 1; Stock number: not stored; Number of rows: 2

## Sheet Curr_Volt_Measurement.SchDoc
size A4; Author: D. Hufnagel; CompanyName: Technische Hochschule Nürnberg Georg Simon Ohm; Organization: UltraZohm; Address1: Kesslerplatz 12; Address2: 90489 Nürnberg; Address3: GERMANY; SheetNumber: 6; SheetTotal: 7; Website: www.ultrazohm.com
Used 3 times, as channels Curr_Volt_Measurement1, Curr_Volt_Measurement2, Curr_Volt_Measurement3. Parts and nets are listed once, with the designators drawn on the sheet.
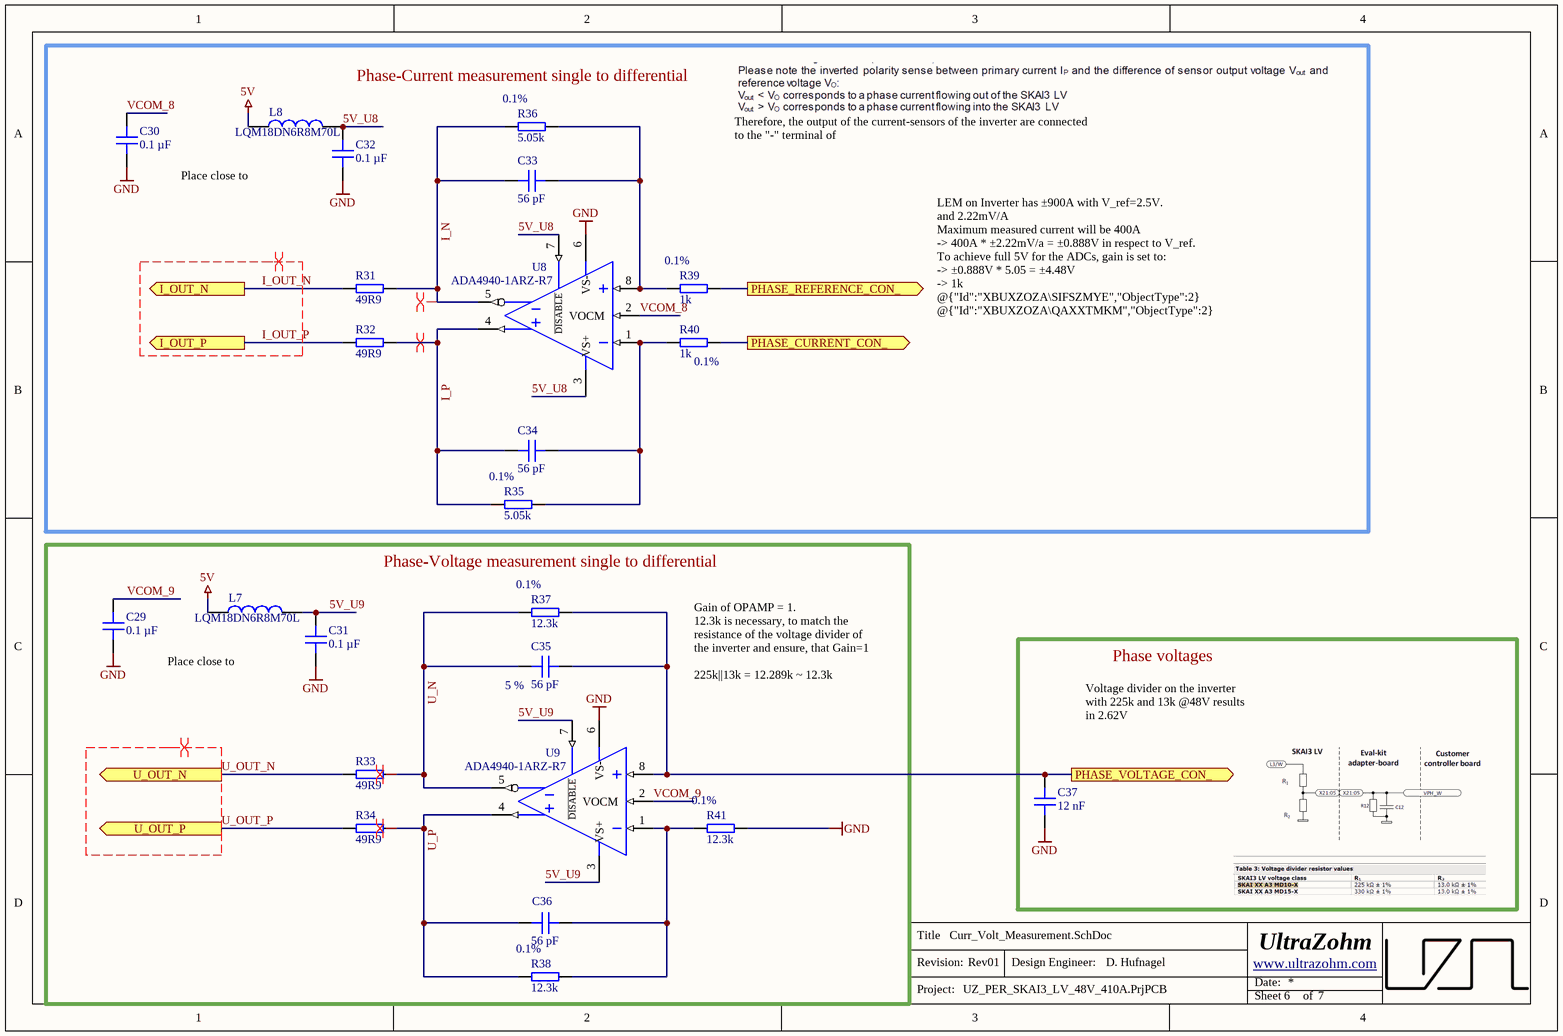
[diagram p3: Curr_Volt_Measurement.SchDoc]

### Parts
C29  0.1 µF  [C_0603]
C30  0.1 µF  [C_0603]
C31  0.1 µF  [C_0603]
C32  0.1 µF  [C_0603]
C33  56 pF  [C_0603]
C34  56 pF  [C_0603]
C35  56 pF  Tolerance: 5 %  [C_0603]
C36  56 pF  [C_0603]
C37  12 nF  [C_0603]
L7  LQM18DN6R8M70L  [INDC1608X95N]
L8  LQM18DN6R8M70L  [INDC1608X95N]
R31  49R9  [RES 0603_1608]
R32  49R9  [RES 0603_1608]
R33  49R9  [RES 0603_1608]
R34  49R9  [RES 0603_1608]
R35  5.05k  Tolerance: 0.1%  [RES 0603_1608]
R36  5.05k  Tolerance: 0.1%  [RES 0603_1608]
R37  12.3k  Tolerance: 0.1%  [RES 0603_1608]
R38  12.3k  Tolerance: 0.1%  [RES 0603_1608]
R39  1k  Tolerance: 0.1%  [RES 0603_1608]
R40  1k  Tolerance: 0.1%  [RES 0603_1608]
R41  12.3k  Tolerance: 0.1%  [RES 0603_1608]
U8  ADA4940-1ARZ-R7  [SOT127P600X175-8N]
U9  ADA4940-1ARZ-R7  [SOT127P600X175-8N]

### Blocks framed on the sheet
Phase-Current measurement single to differential: C30 C32-C34 L8 R31 R32 R35 R36 R39 R40 U8
Phase-Voltage measurement single to differential: C29 C31 C35 C36 L7 R33 R34 R37 R38 R41 U9
Phase voltages: C37

### Ports
I_OUT_N (out), I_OUT_P (out), PHASE_CURRENT_CON_ (out), PHASE_REFERENCE_CON_ (out), PHASE_VOLTAGE_CON_ (out), U_OUT_N (out), U_OUT_P (out)

### Nets
5V: L7.1 L8.1
GND: C29.1 C30.1 C31.1 C32.1 C37.1 R41.2 U8.6(VS-) U9.6(VS-)
5V_U8: C32.2 L8.2 U8.3(VS+) U8.7(~{DISABLE})
5V_U9: C31.2 L7.2 U9.3(VS+) U9.7(~{DISABLE})
I_N: C33.1 R31.2 R36.1 U8.5(VOUT-)
I_OUT_N: R31.1 ; port I_OUT_N
I_OUT_P: R32.1 ; port I_OUT_P
I_P: C34.1 R32.2 R35.1 U8.4(VOUT+)
PHASE_CURRENT_CON_: R40.2 ; port PHASE_CURRENT_CON_
PHASE_REFERENCE_CON_: R39.2 ; port PHASE_REFERENCE_CON_
PHASE_VOLTAGE_CON_: C35.2 C37.2 R37.2 U9.8(VIN+) ; port PHASE_VOLTAGE_CON_
U_N: C35.1 R33.2 R37.1 U9.5(VOUT-)
U_OUT_N: R33.1 ; port U_OUT_N
U_OUT_P: R34.1 ; port U_OUT_P
U_P: C36.1 R34.2 R38.1 U9.4(VOUT+)
VCOM_8: C30.2 U8.2(VOCM)
VCOM_9: C29.2 U9.2(VOCM)
NetC33_2: C33.2 R36.2 R39.1 U8.8(VIN+)
NetC34_2: C34.2 R35.2 R40.1 U8.1(VIN-)
NetC36_2: C36.2 R38.2 R41.1 U9.1(VIN-)

### Channels
Curr_Volt_Measurement1: designators end in A; ports I_OUT_N=I_OUT_N I_OUT_P=I_OUT_P PHASE_CURRENT_CON_=PHASE_CURRENT_CON_1 PHASE_REFERENCE_CON_=PHASE_REFERENCE_CON_1 PHASE_VOLTAGE_CON_=PHASE_VOLTAGE_CON_1 U_OUT_N=U_OUT_N U_OUT_P=U_OUT_P
Curr_Volt_Measurement2: designators end in B; ports I_OUT_N=I_OUT_N I_OUT_P=I_OUT_P PHASE_CURRENT_CON_=PHASE_CURRENT_CON_2 PHASE_REFERENCE_CON_=PHASE_REFERENCE_CON_2 PHASE_VOLTAGE_CON_=PHASE_VOLTAGE_CON_2 U_OUT_N=U_OUT_N U_OUT_P=U_OUT_P
Curr_Volt_Measurement3: designators end in C; ports I_OUT_N=I_OUT_N I_OUT_P=I_OUT_P PHASE_CURRENT_CON_=PHASE_CURRENT_CON_3 PHASE_REFERENCE_CON_=PHASE_REFERENCE_CON_3 PHASE_VOLTAGE_CON_=PHASE_VOLTAGE_CON_3 U_OUT_N=U_OUT_N U_OUT_P=U_OUT_P

### Layout directives
differential pair: I_N_Curr_Volt_Measurement1, I_OUT_N, I_OUT_P, I_P_Curr_Volt_Measurement1, U_N_Curr_Volt_Measurement1, U_OUT_N, U_OUT_P, U_P_Curr_Volt_Measurement1

### Notes on the sheet
- Place close to @{"Id":"XBUXZOZA\MTJQITXN","ObjectType":2}
- Therefore, the output of the current-sensors of the inverter are connected to the "-" terminal of @{"Id":"XBUXZOZA\MTJQITXN","ObjectType":2}
- LEM on Inverter has ±900A with V_ref=2.5V.
  and 2.22mV/A
  Maximum measured current will be 400A
  -> 400A * ±2.22mV/a = ±0.888V in respect to V_ref.
  To achieve full 5V for the ADCs, gain is set to:
  -> ±0.888V * 5.05 = ±4.48V
  -> 1k @{"Id":"XBUXZOZA\SIFSZMYE","ObjectType":2} @{"Id":"XBUXZOZA\QAXXTMKM","ObjectType":2}
  -> 5.05k @{"Id":"XBUXZOZA\UHEFABPJ","ObjectType":2} @{"Id":"XBUXZOZA\VOLTYTTG","ObjectType":2}
- Place close to @{"Id":"XBUXZOZA\QRBCBRVC","ObjectType":2}
- Gain of OPAMP = 1.
  12.3k is necessary, to match the resistance of the voltage divider of the inverter and ensure, that Gain=1
  225k||13k = 12.289k ~ 12.3k
- Voltage divider on the inverter with 225k and 13k @48V results in 2.62V
- Title
- Revision:
- Design Engineer:
- Date:
- Project:
- Sheet
- of

### Library data of the parts
C29-C32 = C0603X104K5RAC7411: as C19 on sheet Temp_V_DC_Measurement; Manufacturer Part Number: C0603X104K5RAC7411; PartID: 3; Created On: 20.12.2020 13:54:13; ComponentLink1Description: Datasheet; ComponentLink1URL: https://www.mouser.de/datasheet/2/212/1/KEM_C1013_X7R_FT_CAP_SMD-1103280.pdf; Component Type: Capacitor 0603; Device Package: 0603; Last Updated: 04.03.2021 09:24:28; Mounting Type: SMD; Operating Temperature: -55 - 125°C; Series: SMD Comm X7R Flex; Supplier 1: Mouser; Supplier Part Number 1: 80-C0603X104K5R7411; Supplier 2: LCSC; Supplier Part Number 2: C14663; Type: Capacitor; Value: 0.1 µF; Live Cycle Status: 1; LCSC Part Number: C14663; Stock number: Labor SMD Container
C33 C34 C36 = CL10C560JB8NNNC: as C24 on sheet Temp_V_DC_Measurement; Manufacturer Part Number: CL10C560JB8NNNC; PartID: 92; Created On: 20.12.2020 13:54:13; ComponentLink1Description: Datasheet; ComponentLink1URL: https://www.mouser.de/datasheet/2/585/MLCC-1837944.pdf; Component Type: Capacitor 0603; Device Package: 0603; Last Updated: 20.12.2020 16:24:16; Mounting Type: SMD; Operating Temperature: -55 - 125°C; Series: CL; Supplier 1: Mouser; Supplier Part Number 1: 187-CL10C560JB8NNNC; Supplier 2: LCSC; Supplier Part Number 2: C39148; Type: Capacitor; Value: 56 pF; Live Cycle Status: 1; LCSC Part Number: C39148; Stock number: not stored
C35 = CL10C560JB8NNNC: as C23 on sheet Temp_V_DC_Measurement; Manufacturer Part Number: CL10C560JB8NNNC; PartID: 92; Created On: 20.12.2020 13:54:13; ComponentLink1Description: Datasheet; ComponentLink1URL: https://www.mouser.de/datasheet/2/585/MLCC-1837944.pdf; Component Type: Capacitor 0603; Device Package: 0603; Last Updated: 20.12.2020 16:24:16; Mounting Type: SMD; Operating Temperature: -55 - 125°C; Series: CL; Supplier 1: Mouser; Supplier Part Number 1: 187-CL10C560JB8NNNC; Type: Capacitor; Value: 56 pF; Live Cycle Status: 1; Stock number: not stored; Supplier 2: LCSC; Supplier Part Number 2: C39148; LCSC Part Number: C39148
C37 = CC0603KRX7R7BB123: as C27 on sheet Temp_V_DC_Measurement; Manufacturer Part Number: CC0603KRX7R7BB123; PartID: 47; Created On: 20.12.2020 13:54:13; ComponentLink1Description: Datasheet; ComponentLink1URL: https://www.mouser.de/datasheet/2/447/UPY-GPHC_X7R_6.3V-to-50V_18-1154002.pdf; Component Type: Capacitor 0603; Device Package: 0603; Last Updated: 16.04.2024 13:21:40; Mounting Type: SMD; Operating Temperature: -55 - 125°C; Series: CC; Supplier 1: Mouser; Supplier Part Number 1: 603-CC603KRX7R7BB123; Type: Capacitor; Value: 12 nF; Live Cycle Status: 1; LCSC Part Number: C519427; Stock number: not stored
L7 L8 = LQM18DN6R8M70L: as L5 on sheet Temp_V_DC_Measurement; MPN: B82464G4154M; Supplier 1: Mouser; Supplier Part Number 1: 81-LQM18DN6R8M70L; Manufacturer Part Number: LQM18DN6R8M70L; PartID: 10; Created On: 19.07.2022 15:47:17; ComponentLink1Description: Datasheet; ComponentLink1URL: https://www.mouser.de/datasheet/2/281/1/JELF243B_0086-2298241.pdf; Component Type: SMD fixed inductor; Device Package: SMD; Last Updated: 15.06.2023 16:03:16; Mounting Type: SMD; Operating Temperature: -40 - 125°C; Series: LQM18DN_70; Supplier 2: Digi-Key; Supplier Part Number 2: 490-LQM18DN6R8M70LCT-ND; DC current: 120mA; Live Cycle Status: 1; Stock number: not stored; LCSC Part Number: C1881372
R31-R34 = RK73H1JTTD49R9F: as R18 on sheet Temp_V_DC_Measurement; Manufacturer Part Number: RK73H1JTTD49R9F; PartID: 214; Created On: 14.12.2020 16:17:14; ComponentLink1Description: Datasheet; ComponentLink1URL: https://www.mouser.de/datasheet/2/219/RK73H-1825326.pdf; Component Type: SMD resistor; Device Package: 0603; Last Updated: 27.05.2022 13:46:35; Mounting Type: SMD; Supplier 1: Mouser; Supplier Part Number 1: 660-RK73H1JTTD49R9F; Supplier 2: LCSC; Supplier Part Number 2: C160046; Type: Resistor; Tolerance: 1%; Value: 49R9; Live Cycle Status: 1; Stock number: not stored; LCSC Part Number: C160046
R35 R36 = TNPW06035K05BEEA: as R29 on sheet Temp_V_DC_Measurement; Manufacturer Part Number: TNPW06035K05BEEA; PartID: 338; Created On: 01.12.2022 09:50:56; ComponentLink1Description: Datasheet; ComponentLink1URL: https://www.vishay.com/doc?28758; Component Type: SMD resistor; Device Package: 0603; Last Updated: 03.05.2024 10:51:07; Mounting Type: SMD; Supplier 1: Mouser; Supplier Part Number 1: 71-TNPW06035K05BEEA; Type: Resistor; Value: 5.05k; Live Cycle Status: 1; Stock number: not stored; LCSC Part Number: C1693738
R37 R38 R41 = RT0603BRD0712K3L: as R24 on sheet Temp_V_DC_Measurement; Manufacturer Part Number: RT0603BRD0712K3L; PartID: 333; Created On: 10.02.2023 10:27:45; ComponentLink1Description: Datasheet; ComponentLink1URL: https://www.mouser.de/datasheet/2/447/PYu_RT_1_to_0_01_RoHS_L_12-3003070.pdf; Component Type: SMD resistor; Device Package: 0603; Last Updated: 03.05.2024 10:37:15; Mounting Type: SMD; Supplier 1: Mouser; Supplier Part Number 1: 603-RT0603BRD0712K3L; Type: Resistor; Value: 12.3k; Live Cycle Status: 1; Stock number: not stored; LCSC Part Number: C861101
R39 R40 = PCF-W0603LF-03-1001-B-P-LT: as R22 on sheet Temp_V_DC_Measurement; Manufacturer Part Number: PCF-W0603LF-03-1001-B-P-LT; PartID: 163; Created On: 14.12.2020 16:17:14; ComponentLink1Description: Datasheet; ComponentLink1URL: https://www.mouser.de/datasheet/2/414/PCF-1528243.pdf; Component Type: SMD resistor; Device Package: 0603; Last Updated: 21.02.2024 15:45:55; Mounting Type: SMD; Supplier 1: Mouser; Supplier Part Number 1: 66-PCFW0603LF031001B; Type: Resistor; Value: 1k; Live Cycle Status: 1; Stock number: not stored; LCSC Part Number: C110776
U8 U9 = ADA4940-1ARZ-R7: as U6 on sheet Temp_V_DC_Measurement; Manufacturer Part Number: ADA4940-1ARZ-R7; PartID: 14; Created On: 18.08.2022 12:53:27; ComponentLink1Description: Datasheet; ComponentLink1URL: https://www.mouser.de/datasheet/2/609/ada4940_1_4940_2-2955874.pdf; Component Type: Differential Amplifier; Device Package: SOIC-8; Last Updated: 18.08.2022 13:04:18; Mounting Type: SMD; Operating Temperature: -40 - 105°C; Series: ADA4940-1; Supplier 1: Mouser; Supplier Part Number 1: 584-ADA4940-1ARZ; Supplier 2: Digi-Key; Supplier Part Number 2: 505-ADA4940-1ARZ-ND; Supplier 3: LCSC; Supplier Part Number 3: C730049; Type: Differential Amplifiers; Live Cycle Status: 1; LCSC Part Number: C730049; Stock number: not stored

## Sheet Receiver.SchDoc
size A4; Author: D. Hufnagel; CompanyName: Technische Hochschule Nürnberg Georg Simon Ohm; Organization: UltraZohm; Address1: Kesslerplatz 12; Address2: 90489 Nürnberg; Address3: GERMANY; SheetNumber: 3; SheetTotal: 7; Website: www.ultrazohm.com
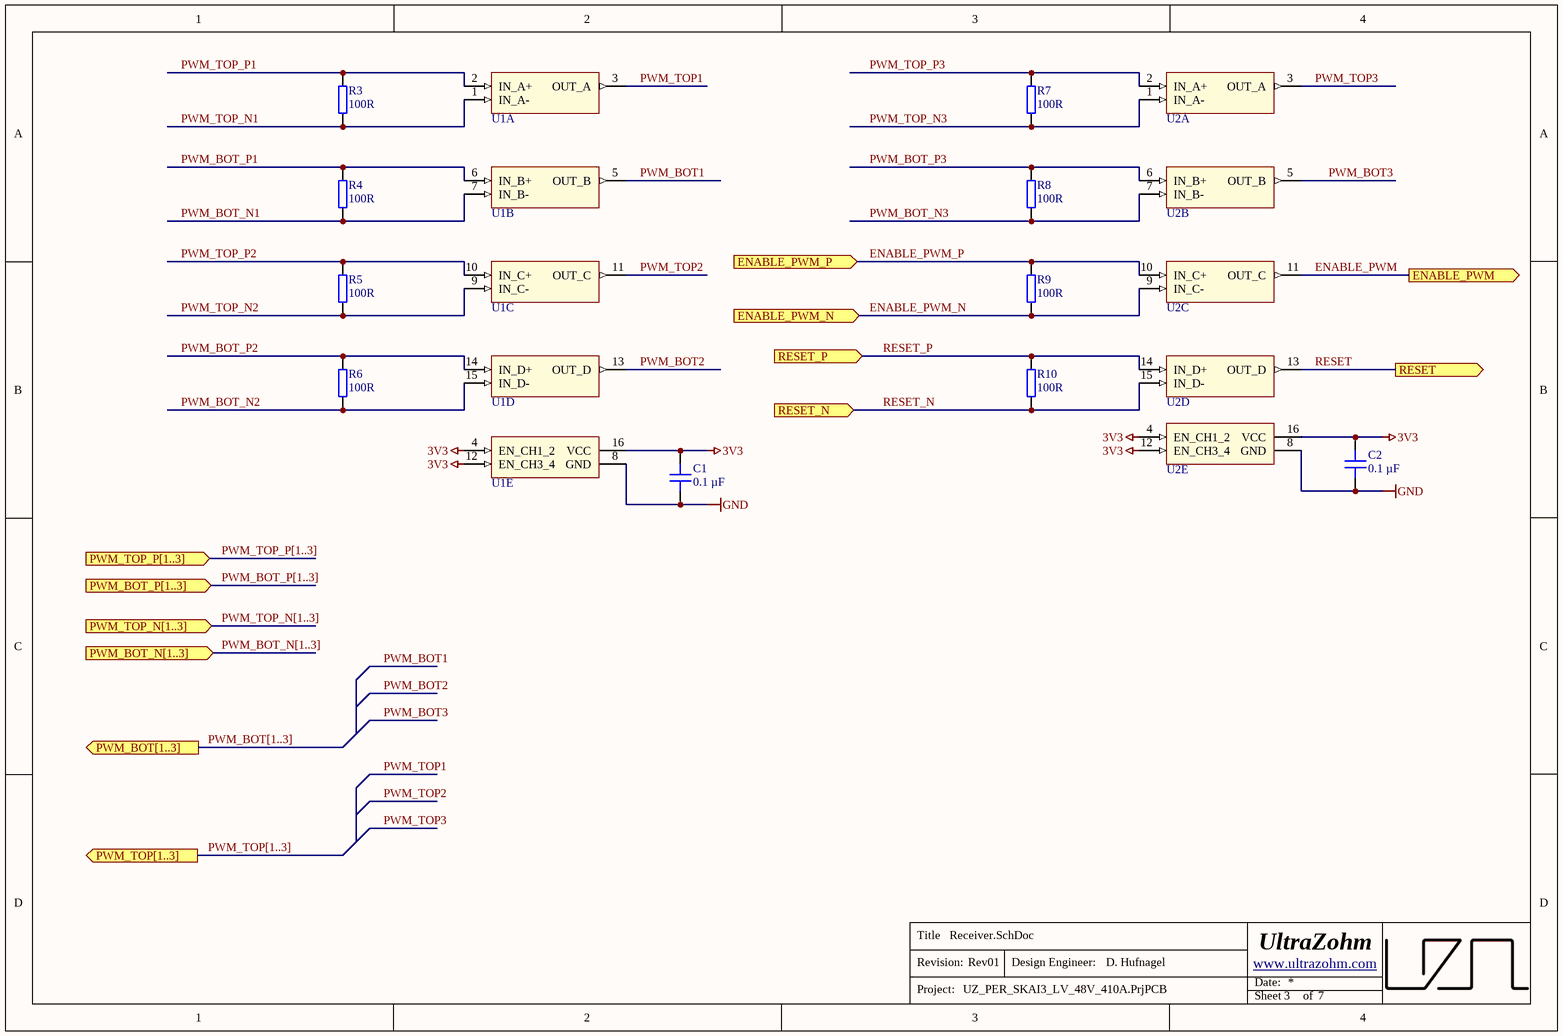
[diagram p4: Receiver.SchDoc]

### Parts
C1  0.1 µF  [C_0603]
C2  0.1 µF  [C_0603]
R3  100R  [RES 0603_1608]
R4  100R  [RES 0603_1608]
R5  100R  [RES 0603_1608]
R6  100R  [RES 0603_1608]
R7  100R  [RES 0603_1608]
R8  100R  [RES 0603_1608]
R9  100R  [RES 0603_1608]
R10  100R  [RES 0603_1608]
U1  DS34LV86TM/NOPB  [TI_D-R-PDSO-G16_N]  (value not drawn)  (parts A,B,C,D,E of 5)
U2  DS34LV86TM/NOPB  [TI_D-R-PDSO-G16_N]  (value not drawn)  (parts A,B,C,D,E of 5)

### Ports
ENABLE_PWM (out), ENABLE_PWM_N (in), ENABLE_PWM_P (in), PWM_BOT[1..3] (out), PWM_BOT_N[1..3] (in), PWM_BOT_P[1..3] (in), PWM_TOP[1..3] (out), PWM_TOP_N[1..3] (in), PWM_TOP_P[1..3] (in), RESET (out), RESET_N (in), RESET_P (in)

### Nets
3V3: C1.2 C2.2 U1.4(EN_CH1_2) U1.12(EN_CH3_4) U1.16(VCC) U2.4(EN_CH1_2) U2.12(EN_CH3_4) U2.16(VCC)
GND: C1.1 C2.1 U1.8(GND) U2.8(GND)
ENABLE_PWM: U2.11(OUT_C) ; port ENABLE_PWM
ENABLE_PWM_N: R9.1 U2.9(IN_C-) ; port ENABLE_PWM_N
ENABLE_PWM_P: R9.2 U2.10(IN_C+) ; port ENABLE_PWM_P
PWM_BOT1: U1.5(OUT_B)
PWM_BOT2: U1.13(OUT_D)
PWM_BOT3: U2.5(OUT_B)
PWM_BOT_N1: R4.1 U1.7(IN_B-)
PWM_BOT_N2: R6.1 U1.15(IN_D-)
PWM_BOT_N3: R8.1 U2.7(IN_B-)
PWM_BOT_P1: R4.2 U1.6(IN_B+)
PWM_BOT_P2: R6.2 U1.14(IN_D+)
PWM_BOT_P3: R8.2 U2.6(IN_B+)
PWM_TOP1: U1.3(OUT_A)
PWM_TOP2: U1.11(OUT_C)
PWM_TOP3: U2.3(OUT_A)
PWM_TOP_N1: R3.1 U1.1(IN_A-)
PWM_TOP_N2: R5.1 U1.9(IN_C-)
PWM_TOP_N3: R7.1 U2.1(IN_A-)
PWM_TOP_P1: R3.2 U1.2(IN_A+)
PWM_TOP_P2: R5.2 U1.10(IN_C+)
PWM_TOP_P3: R7.2 U2.2(IN_A+)
RESET: U2.13(OUT_D) ; port RESET
RESET_N: R10.1 U2.15(IN_D-) ; port RESET_N
RESET_P: R10.2 U2.14(IN_D+) ; port RESET_P

### Buses and harness runs
bus PWM_BOT[1..3] = port PWM_BOT[1..3]
bus PWM_BOT_N[1..3] = port PWM_BOT_N[1..3]
bus PWM_BOT_P[1..3] = port PWM_BOT_P[1..3]
bus PWM_TOP[1..3] = port PWM_TOP[1..3]
bus PWM_TOP_N[1..3] = port PWM_TOP_N[1..3]
bus PWM_TOP_P[1..3] = port PWM_TOP_P[1..3]

### Notes on the sheet
- Title
- Revision:
- Design Engineer:
- Date:
- Project:
- Sheet
- of

### Library data of the parts
C1 C2 = C0603X104K5RAC7411: as C19 on sheet Temp_V_DC_Measurement; Manufacturer Part Number: C0603X104K5RAC7411; PartID: 3; Created On: 20.12.2020 13:54:13; ComponentLink1Description: Datasheet; ComponentLink1URL: https://www.mouser.de/datasheet/2/212/1/KEM_C1013_X7R_FT_CAP_SMD-1103280.pdf; Component Type: Capacitor 0603; Device Package: 0603; Last Updated: 04.03.2021 09:24:28; Mounting Type: SMD; Operating Temperature: -55 - 125°C; Series: SMD Comm X7R Flex; Supplier 1: Mouser; Supplier Part Number 1: 80-C0603X104K5R7411; Supplier 2: LCSC; Supplier Part Number 2: C14663; Type: Capacitor; Value: 0.1 µF; Live Cycle Status: 1; LCSC Part Number: C14663; Stock number: Labor SMD Container
R3-R10 = RK73B1JTTD101J: SMD resistor E24 series; Manufacturer: KOA Speer; Tolerance: 5%; Created from: MGremer; Manufacturer Part Number: RK73B1JTTD101J; PartID: 50; Created On: 14.12.2020 16:17:14; ComponentLink1Description: Datasheet; ComponentLink1URL: https://www.mouser.de/datasheet/2/219/RK73B-1825463.pdf; Component Type: SMD resistor; Device Package: 0603; Last Updated: 29.11.2022 14:30:07; Mounting Type: SMD; Supplier 1: Mouser; Supplier Part Number 1: 660-RK73B1JTTD101J; Supplier 2: LCSC; Supplier Part Number 2: C22775; Type: Resistor; Value: 100R; Live Cycle Status: 1; Stock number: Labor SMD Container; LCSC Part Number: C22775
U1 U2 = DS34LV86TM/NOPB: 3V Enhanced CMOS Quad Differential Line Receiver, 16-pin Narrow SOIC, Pb-Free; Manufacturer: Texas Instruments; Created from: D. Hufnagel; Manufacturer Part Number: DS34LV86TM/NOPB; PartID: 9; Created On: 01.03.2021 10:35:45; ComponentLink1Description: Datasheet; ComponentLink1URL: https://www.ti.com/lit/gpn/ds34lv86t; Component Type: RS422 Receiver; Device Package: SOIC; Last Updated: 04.03.2021 09:04:43; Minimum Order: 1; Mounting Type: SMD; Operating Temperature: -40°C - 85°C; Series: DS34LV86T; Supplier 1: Mouser; Supplier Part Number 1: 926-DS26LV32ATM/NOPB; Supplier 2: Mouser; Supplier Part Number 2: 926-DS34LV86TM/NOPB; Supplier 3: LCSC; Supplier Part Number 3: C181570; Type: Standard; Live Cycle Status: 1; Stock number: not stored; LCSC Part Number: C181570

## Sheet Transmitter.SchDoc
size A4; SheetNumber: 7; SheetTotal: 7
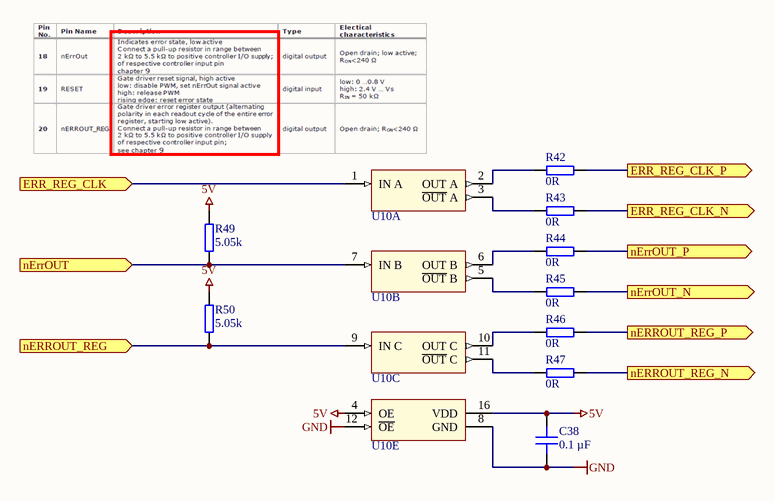
[diagram p5: Transmitter.SchDoc]

### Parts
C38  0.1 µF  [C_0603]
R42  0R  [RES 0603_1608]
R43  0R  [RES 0603_1608]
R44  0R  [RES 0603_1608]
R45  0R  [RES 0603_1608]
R46  0R  [RES 0603_1608]
R47  0R  [RES 0603_1608]
R49  5.05k  [RES 0603_1608]
R50  5.05k  [RES 0603_1608]
U10  DS26C31TMX/NOPB  [TI_D-R-PDSO-G16_N]  (value not drawn)  (parts A,B,C,E of 5)

### Ports
ERR_REG_CLK (in), ERR_REG_CLK_N (out), ERR_REG_CLK_P (out), nErrOUT (in), nErrOUT_N (out), nErrOUT_P (out), nERROUT_REG (in), nERROUT_REG_N (out), nERROUT_REG_P (out)

### Nets
5V: C38.2 R49.2 R50.2 U10.4(OE) U10.16(VDD)
GND: C38.1 U10.8(GND) U10.12(~{OE})
ERR_REG_CLK: U10.1(IN_A) ; port ERR_REG_CLK
ERR_REG_CLK_N: R43.2 ; port ERR_REG_CLK_N
ERR_REG_CLK_P: R42.2 ; port ERR_REG_CLK_P
nErrOUT: R49.1 U10.7(IN_B) ; port nErrOUT
nErrOUT_N: R45.2 ; port nErrOUT_N
nErrOUT_P: R44.2 ; port nErrOUT_P
nERROUT_REG: R50.1 U10.9(IN_C) ; port nERROUT_REG
nERROUT_REG_N: R47.2 ; port nERROUT_REG_N
nERROUT_REG_P: R46.2 ; port nERROUT_REG_P
NetR42_1: R42.1 U10.2(OUT_A)
NetR43_1: R43.1 U10.3(~{OUT}_A)
NetR44_1: R44.1 U10.6(OUT_B)
NetR45_1: R45.1 U10.5(~{OUT}_B)
NetR46_1: R46.1 U10.10(OUT_C)
NetR47_1: R47.1 U10.11(~{OUT}_C)

### Library data of the parts
C38 = C0603X104K5RAC7411: as C19 on sheet Temp_V_DC_Measurement; Manufacturer Part Number: C0603X104K5RAC7411; PartID: 3; Created On: 20.12.2020 13:54:13; ComponentLink1Description: Datasheet; ComponentLink1URL: https://www.mouser.de/datasheet/2/212/1/KEM_C1013_X7R_FT_CAP_SMD-1103280.pdf; Component Type: Capacitor 0603; Device Package: 0603; Last Updated: 04.03.2021 09:24:28; Mounting Type: SMD; Operating Temperature: -55 - 125°C; Series: SMD Comm X7R Flex; Supplier 1: Mouser; Supplier Part Number 1: 80-C0603X104K5R7411; Supplier 2: LCSC; Supplier Part Number 2: C14663; Type: Capacitor; Value: 0.1 µF; Live Cycle Status: 1; LCSC Part Number: C14663; Stock number: Labor SMD Container
R42-R47 = RC0603JR-070RL: as R30 on sheet Temp_V_DC_Measurement; Manufacturer Part Number: RC0603JR-070RL; PartID: 1; Created On: 14.12.2020 16:17:14; ComponentLink1Description: Datasheet; ComponentLink1URL: https://www.mouser.de/datasheet/2/447/PYu-RC_Group_51_RoHS_L_10-1664068.pdf; Component Type: SMD resistor; Device Package: 0603; Last Updated: 04.03.2021 09:09:42; Mounting Type: SMD; Supplier 1: Mouser; Supplier Part Number 1: 603-RC0603JR-070RL; Supplier 2: LCSC; Supplier Part Number 2: C21189; Type: Resistor; Value: 0R; Live Cycle Status: 1; Stock number: Labor SMD Container; LCSC Part Number: C21189
R49 R50 = TNPW06035K05BEEA: as R29 on sheet Temp_V_DC_Measurement; Manufacturer Part Number: TNPW06035K05BEEA; PartID: 338; Created On: 01.12.2022 09:50:56; ComponentLink1Description: Datasheet; ComponentLink1URL: https://www.vishay.com/doc?28758; Component Type: SMD resistor; Device Package: 0603; Last Updated: 03.05.2024 10:51:07; Mounting Type: SMD; Supplier 1: Mouser; Supplier Part Number 1: 71-TNPW06035K05BEEA; Type: Resistor; Tolerance: 0.1%; Value: 5.05k; Live Cycle Status: 1; Stock number: not stored; LCSC Part Number: C1693738
U10 = DS26C31TMX/NOPB: CMOS Quad Tri-State Differential Line Drivers, 16-pin Narrow SOIC, Pb-Free; Manufacturer: Texas Instruments; Created from: T. Wendt; Manufacturer Part Number: DS26C31TMX/NOPB; PartID: 1; Created On: 01.03.2021 10:08:45; ComponentLink1Description: Datasheet; ComponentLink1URL: http://www.ti.com/general/docs/lit/getliterature.tsp?genericPartNumber=DS26C31T&fileType=pdf; Component Type: RS422 Driver; Device Package: SOIC; Last Updated: 04.03.2021 09:04:43; Minimum Order: 1; Mounting Type: SMD; Operating Temperature: -40°C - 85°C; Series: DS26C31; Supplier 1: Digi-Key; Supplier Part Number 1: DS26C31TMX/NOPBCT-ND; Supplier 2: Mouser; Supplier Part Number 2: 926-DS26C31TMX/NOPB; Supplier 3: LCSC; Supplier Part Number 3: C132085; Type: Standard; Live Cycle Status: 1; Stock number: not stored; LCSC Part Number: C132085